# Altium schematic sheet top_schem_rev10.SchDoc
size A; SheetNumber: 1; SheetTotal: 1
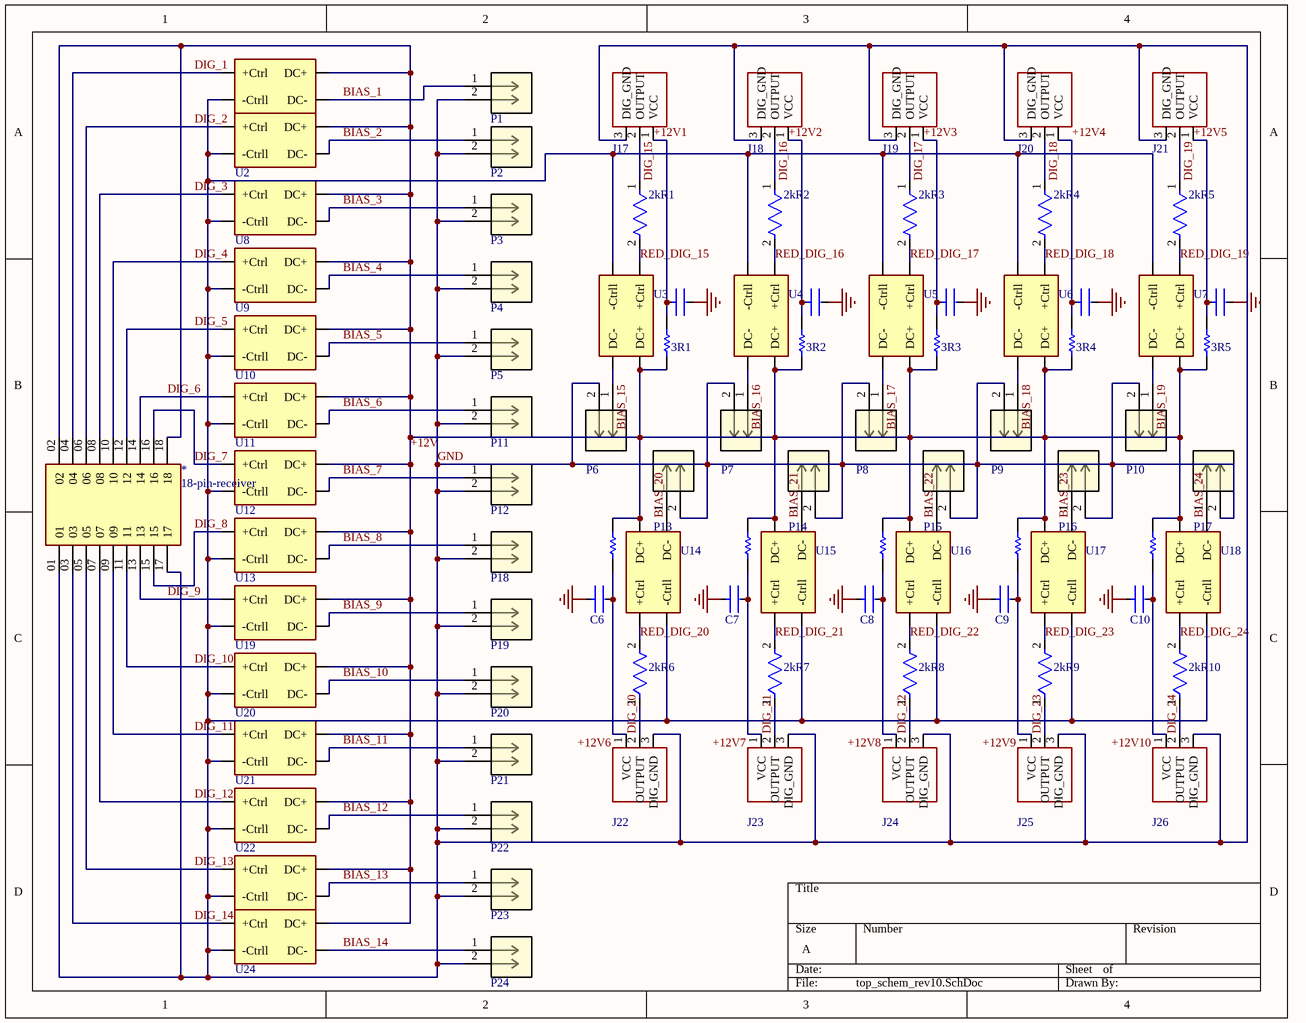
[diagram p0: top_schem_rev10.SchDoc]

## Parts
2kR1  CRCW06031K80FKEA  [2kOhm]  (value not drawn)
2kR2  CRCW06031K80FKEA  [2kOhm]  (value not drawn)
2kR3  CRCW06031K80FKEA  [2kOhm]  (value not drawn)
2kR4  CRCW06031K80FKEA  [2kOhm]  (value not drawn)
2kR5  CRCW06031K80FKEA  [2kOhm]  (value not drawn)
2kR6  CRCW06031K80FKEA  [2kOhm]  (value not drawn)
2kR7  CRCW06031K80FKEA  [2kOhm]  (value not drawn)
2kR8  CRCW06031K80FKEA  [2kOhm]  (value not drawn)
2kR9  CRCW06031K80FKEA  [2kOhm]  (value not drawn)
2kR10  CRCW06031K80FKEA  [2kOhm]  (value not drawn)
3R1  ERJ-2BQJR30X  [03 Ohm]  (value not drawn)
3R2  ERJ-2BQJR30X  [03 Ohm]  (value not drawn)
3R3  ERJ-2BQJR30X  [03 Ohm]  (value not drawn)
3R4  ERJ-2BQJR30X  [03 Ohm]  (value not drawn)
3R5  ERJ-2BQJR30X  [03 Ohm]  (value not drawn)
3R6  ERJ-2BQJR30X  [03 Ohm]  (value not drawn)
3R7  ERJ-2BQJR30X  [03 Ohm]  (value not drawn)
3R8  ERJ-2BQJR30X  [03 Ohm]  (value not drawn)
3R9  ERJ-2BQJR30X  [03 Ohm]  (value not drawn)
3R10  ERJ-2BQJR30X  [03 Ohm]  (value not drawn)
*  18-pin-receiver  [18-pin-receiver]
C1  C0805C104K5RACTU  [100nF]  (value not drawn)
C2  C0805C104K5RACTU  [100nF]  (value not drawn)
C3  C0805C104K5RACTU  [100nF]  (value not drawn)
C4  C0805C104K5RACTU  [100nF]  (value not drawn)
C5  C0805C104K5RACTU  [100nF]  (value not drawn)
C6  C0805C104K5RACTU  [100nF]  (value not drawn)
C7  C0805C104K5RACTU  [100nF]  (value not drawn)
C8  C0805C104K5RACTU  [100nF]  (value not drawn)
C9  C0805C104K5RACTU  [100nF]  (value not drawn)
C10  C0805C104K5RACTU  [100nF]  (value not drawn)
J17  IF-D95T  [IF-D95]  (value not drawn)
J18  IF-D95T  [IF-D95]  (value not drawn)
J19  IF-D95T  [IF-D95]  (value not drawn)
J20  IF-D95T  [IF-D95]  (value not drawn)
J21  IF-D95T  [IF-D95]  (value not drawn)
J22  IF-D95T  [IF-D95]  (value not drawn)
J23  IF-D95T  [IF-D95]  (value not drawn)
J24  IF-D95T  [IF-D95]  (value not drawn)
J25  IF-D95T  [IF-D95]  (value not drawn)
J26  IF-D95T  [IF-D95]  (value not drawn)
P1  1054311102  [CONN_1054311102_MOL]  (value not drawn)
P2  1054311102  [CONN_1054311102_MOL]  (value not drawn)
P3  1054311102  [CONN_1054311102_MOL]  (value not drawn)
P4  1054311102  [CONN_1054311102_MOL]  (value not drawn)
P5  1054311102  [CONN_1054311102_MOL]  (value not drawn)
P6  1054311102  [CONN_1054311102_MOL]  (value not drawn)
P7  1054311102  [CONN_1054311102_MOL]  (value not drawn)
P8  1054311102  [CONN_1054311102_MOL]  (value not drawn)
P9  1054311102  [CONN_1054311102_MOL]  (value not drawn)
P10  1054311102  [CONN_1054311102_MOL]  (value not drawn)
P11  1054311102  [CONN_1054311102_MOL]  (value not drawn)
P12  1054311102  [CONN_1054311102_MOL]  (value not drawn)
P13  1054311102  [CONN_1054311102_MOL]  (value not drawn)
P14  1054311102  [CONN_1054311102_MOL]  (value not drawn)
P15  1054311102  [CONN_1054311102_MOL]  (value not drawn)
P16  1054311102  [CONN_1054311102_MOL]  (value not drawn)
P17  1054311102  [CONN_1054311102_MOL]  (value not drawn)
P18  1054311102  [CONN_1054311102_MOL]  (value not drawn)
P19  1054311102  [CONN_1054311102_MOL]  (value not drawn)
P20  1054311102  [CONN_1054311102_MOL]  (value not drawn)
P21  1054311102  [CONN_1054311102_MOL]  (value not drawn)
P22  1054311102  [CONN_1054311102_MOL]  (value not drawn)
P23  1054311102  [CONN_1054311102_MOL]  (value not drawn)
P24  1054311102  [CONN_1054311102_MOL]  (value not drawn)
U1  Solid state relay  [CPC1002N]  (value not drawn)
U2  Solid state relay  [CPC1002N]  (value not drawn)
U3  Solid state relay  [CPC1002N]  (value not drawn)
U4  Solid state relay  [CPC1002N]  (value not drawn)
U5  Solid state relay  [CPC1002N]  (value not drawn)
U6  Solid state relay  [CPC1002N]  (value not drawn)
U7  Solid state relay  [CPC1002N]  (value not drawn)
U8  Solid state relay  [CPC1002N]  (value not drawn)
U9  Solid state relay  [CPC1002N]  (value not drawn)
U10  Solid state relay  [CPC1002N]  (value not drawn)
U11  Solid state relay  [CPC1002N]  (value not drawn)
U12  Solid state relay  [CPC1002N]  (value not drawn)
U13  Solid state relay  [CPC1002N]  (value not drawn)
U14  Solid state relay  [CPC1002N]  (value not drawn)
U15  Solid state relay  [CPC1002N]  (value not drawn)
U16  Solid state relay  [CPC1002N]  (value not drawn)
U17  Solid state relay  [CPC1002N]  (value not drawn)
U18  Solid state relay  [CPC1002N]  (value not drawn)
U19  Solid state relay  [CPC1002N]  (value not drawn)
U20  Solid state relay  [CPC1002N]  (value not drawn)
U21  Solid state relay  [CPC1002N]  (value not drawn)
U22  Solid state relay  [CPC1002N]  (value not drawn)
U23  Solid state relay  [CPC1002N]  (value not drawn)
U24  Solid state relay  [CPC1002N]  (value not drawn)

## Nets
GND: *.01 *.17 C1.2 C2.2 C3.2 C4.2 C5.2 C6.1 C7.1 C8.1 C9.1 C10.1 J17.3(DIG_GND) J18.3(DIG_GND) J19.3(DIG_GND) J20.3(DIG_GND) J21.3(DIG_GND) J22.3(DIG_GND) J23.3(DIG_GND) J24.3(DIG_GND) J25.3(DIG_GND) J26.3(DIG_GND) P1.2 P2.2 P3.2 P4.2 P5.2 P6.2 P7.2 P8.2 P9.2 P10.2 P11.2 P12.2 P13.2 P14.2 P15.2 P16.2 P17.2 P18.2 P19.2 P20.2 P21.2 P22.2 P23.2 P24.2 U1.2(-Ctrll) U2.2(-Ctrll) U3.2(-Ctrll) U4.2(-Ctrll) U5.2(-Ctrll) U6.2(-Ctrll) U7.2(-Ctrll) U8.2(-Ctrll) U9.2(-Ctrll) U10.2(-Ctrll) U11.2(-Ctrll) U12.2(-Ctrll) U13.2(-Ctrll) U14.2(-Ctrll) U15.2(-Ctrll) U16.2(-Ctrll) U17.2(-Ctrll) U18.2(-Ctrll) U19.2(-Ctrll) U20.2(-Ctrll) U21.2(-Ctrll) U22.2(-Ctrll) U23.2(-Ctrll) U24.2(-Ctrll)
+12V: 3R1.1 3R2.1 3R3.1 3R4.1 3R5.1 3R6.2 3R7.2 3R8.2 3R9.2 3R10.2 *.02 *.18 U1.4(DC+) U2.4(DC+) U3.4(DC+) U4.4(DC+) U5.4(DC+) U6.4(DC+) U7.4(DC+) U8.4(DC+) U9.4(DC+) U10.4(DC+) U11.4(DC+) U12.4(DC+) U13.4(DC+) U14.4(DC+) U15.4(DC+) U16.4(DC+) U17.4(DC+) U18.4(DC+) U19.4(DC+) U20.4(DC+) U21.4(DC+) U22.4(DC+) U23.4(DC+) U24.4(DC+)
+12V1: 3R1.2 C1.1 J17.1(VCC)
+12V2: 3R2.2 C2.1 J18.1(VCC)
+12V3: 3R3.2 C3.1 J19.1(VCC)
+12V4: 3R4.2 C4.1 J20.1(VCC)
+12V5: 3R5.2 C5.1 J21.1(VCC)
+12V6: 3R6.1 C6.2 J22.1(VCC)
+12V7: 3R7.1 C7.2 J23.1(VCC)
+12V8: 3R8.1 C8.2 J24.1(VCC)
+12V9: 3R9.1 C9.2 J25.1(VCC)
+12V10: 3R10.1 C10.2 J26.1(VCC)
BIAS_1: P1.1 U1.3(DC-)
BIAS_2: P2.1 U2.3(DC-)
BIAS_3: P3.1 U8.3(DC-)
BIAS_4: P4.1 U9.3(DC-)
BIAS_5: P5.1 U10.3(DC-)
BIAS_6: P11.1 U11.3(DC-)
BIAS_7: P12.1 U12.3(DC-)
BIAS_8: P18.1 U13.3(DC-)
BIAS_9: P19.1 U19.3(DC-)
BIAS_10: P20.1 U20.3(DC-)
BIAS_11: P21.1 U21.3(DC-)
BIAS_12: P22.1 U22.3(DC-)
BIAS_13: P23.1 U23.3(DC-)
BIAS_14: P24.1 U24.3(DC-)
BIAS_15: P6.1 U3.3(DC-)
BIAS_16: P7.1 U4.3(DC-)
BIAS_17: P8.1 U5.3(DC-)
BIAS_18: P9.1 U6.3(DC-)
BIAS_19: P10.1 U7.3(DC-)
BIAS_20: P13.1 U14.3(DC-)
BIAS_21: P14.1 U15.3(DC-)
BIAS_22: P15.1 U16.3(DC-)
BIAS_23: P16.1 U17.3(DC-)
BIAS_24: P17.1 U18.3(DC-)
DIG_1: *.04 U1.1(+Ctrl)
DIG_2: *.06 U2.1(+Ctrl)
DIG_3: *.08 U8.1(+Ctrl)
DIG_4: *.10 U9.1(+Ctrl)
DIG_5: *.12 U10.1(+Ctrl)
DIG_6: *.14 U11.1(+Ctrl)
DIG_7: *.16 U12.1(+Ctrl)
DIG_8: *.15 U13.1(+Ctrl)
DIG_9: *.13 U19.1(+Ctrl)
DIG_10: *.11 U20.1(+Ctrl)
DIG_11: *.09 U21.1(+Ctrl)
DIG_12: *.07 U22.1(+Ctrl)
DIG_13: *.05 U23.1(+Ctrl)
DIG_14: *.03 U24.1(+Ctrl)
DIG_15: 2kR1.1 J17.2(OUTPUT)
DIG_16: 2kR2.1 J18.2(OUTPUT)
DIG_17: 2kR3.1 J19.2(OUTPUT)
DIG_18: 2kR4.1 J20.2(OUTPUT)
DIG_19: 2kR5.1 J21.2(OUTPUT)
DIG_20: 2kR6.1 J22.2(OUTPUT)
DIG_21: 2kR7.1 J23.2(OUTPUT)
DIG_22: 2kR8.1 J24.2(OUTPUT)
DIG_23: 2kR9.1 J25.2(OUTPUT)
DIG_24: 2kR10.1 J26.2(OUTPUT)
RED_DIG_15: 2kR1.2 U3.1(+Ctrl)
RED_DIG_16: 2kR2.2 U4.1(+Ctrl)
RED_DIG_17: 2kR3.2 U5.1(+Ctrl)
RED_DIG_18: 2kR4.2 U6.1(+Ctrl)
RED_DIG_19: 2kR5.2 U7.1(+Ctrl)
RED_DIG_20: 2kR6.2 U14.1(+Ctrl)
RED_DIG_21: 2kR7.2 U15.1(+Ctrl)
RED_DIG_22: 2kR8.2 U16.1(+Ctrl)
RED_DIG_23: 2kR9.2 U17.1(+Ctrl)
RED_DIG_24: 2kR10.2 U18.1(+Ctrl)

## Library data of the parts
2kR1-2kR10 = CRCW06031K80FKEA: Res Thick Film 0603 1.8K Ohm 1% 1/10W ±100ppm/°C Molded SMD Paper T/R; Manufacturer: Vishay; Resistance: 1.8kR; Power Rating: 100mW; Voltage Rating: 75V; Supplier 1: RSComponents; Manufacturer Part Number: CRCW06031K80FKEA; RoHS: Yes; Category: Chip SMD Resistors; Stock 1: 7900; Pricing 1: 50=0.06500, 500=0.06000, 1000=0.05600, 2000=0.05200, 4000=0.04800 (USD); Case/Package: 0603; Case Code (Metric): 1608; Case Code (Imperial): 0603; Contact Plating: Tin; Weight: 7.1E-05oz; Size Code: 0603; Min Operating Temperature: -55°C; Max Operating Temperature: 155°C; Resistor Type: Thick Film; Tolerance: 1%; Packaging: Tape and Reel; Package Quantity: 5000; Temperature Coefficient: 100ppm/°C; Series: CRCW; Resistance Tolerance: 1%; Number of Terminations: 2; Max Power Dissipation: 100mW; Termination: SMD/SMT; Construction: Rectangular; Voltage Rating (DC): 75V; Features: Automotive AEC-Q200; Technology: THICK FILM; Length: 1.55mm; Width: 0.033inch; Height: 0.45mm; Depth: 0.85mm; Radiation Hardening: No; RoHS Compliant: Yes; REACH SVHC: Unknown; Military Standard: Not; Lead Free: Lead Free; ComponentLink1URL: https://datasheet.ciiva.com/11809/0900766b80d98afc-11809198.pdf?src-supplier=RSComponents; ComponentLink1Description: https://datasheet.ciiva.com/11809/0900766b80d98afc-11809198.pdf?src-supplier=RSComponents; ComponentLink2URL: https://datasheet.ciiva.com/2559/dcrcwe3-2559458.pdf?src-supplier=Digi-Key; ComponentLink2Description: https://datasheet.ciiva.com/2559/dcrcwe3-2559458.pdf?src-supplier=Digi-Key; ComponentLink3URL: https://datasheet.ciiva.com/2559/dcrcwe3-2559459.pdf?src-supplier=Digi-Key; ComponentLink3Description: https://datasheet.ciiva.com/2559/dcrcwe3-2559459.pdf?src-supplier=Digi-Key; ComponentLink4URL: https://datasheet.ciiva.com/2559/dcrcwe3-2559460.pdf?src-supplier=Digi-Key; ComponentLink4Description: https://datasheet.ciiva.com/2559/dcrcwe3-2559460.pdf?src-supplier=Digi-Key; ComponentLink5URL: https://datasheet.ciiva.com/3257/dcrcwe3-3257191.pdf?src-supplier=Avnet; ComponentLink5Description: https://datasheet.ciiva.com/3257/dcrcwe3-3257191.pdf?src-supplier=Avnet; ComponentLink6URL: https://datasheet.ciiva.com/5547/dcrcwe3-109170-5547689.pdf?src-supplier=Mouser; ComponentLink6Description: https://datasheet.ciiva.com/5547/dcrcwe3-109170-5547689.pdf?src-supplier=Mouser; ComponentLink7URL: https://datasheet.ciiva.com/26314/fld-crcw-e3-data-en-26314680.pdf?src-supplier=Distrelec; ComponentLink7Description: https://datasheet.ciiva.com/26314/fld-crcw-e3-data-en-26314680.pdf?src-supplier=Distrelec; ComponentLink8URL: https://datasheet.ciiva.com/22872/70201119-22872444.pdf?src-supplier=Allied+Electronics; ComponentLink8Description: https://datasheet.ciiva.com/22872/70201119-22872444.pdf?src-supplier=Allied+Electronics; ComponentLink9URL: https://datasheet.ciiva.com/7673/1533075-7673143.pdf?src-supplier=Element14; ComponentLink9Description: https://datasheet.ciiva.com/7673/1533075-7673143.pdf?src-supplier=Element14
3R1-3R10 = ERJ-2BQJR30X: RES 0.3 OHM 5% 1/6W 0402; Manufacturer: Panasonic; Max Power Dissipation: 167mW; Temperature Coefficient: 250ppm/°C; Resistance: 300mR; Supplier 1: Digi-Key; Supplier Part Number 1: P17347CT-ND; Manufacturer Part Number: ERJ-2BQJR30X; RoHS: Yes; Category: Chip SMD Resistors; Stock 1: 18282; Pricing 1: 1=0.21000, 10=0.17600, 25=0.12800, 50=0.09280, 100=0.06880, 250=0.05280, 500=0.04160, 1000=0.02880, 5000=0.02400 (USD); Case/Package: 0402; Case Code (Imperial): 0402; Case Code (Metric): 1005; Min Operating Temperature: -55°C; Max Operating Temperature: 125°C; Features: Automotive AEC-Q200; Tolerance: 5%; Packaging: Tape and Reel; Resistor Type: Thick Film; Number of Terminations: 2; Length: 0.039inch; Width: 0.02inch; Height: 0.016inch; ComponentLink1URL: http://www.mouser.com/ds/2/315/AOA0000C295-1109214.pdf?src-supplier=Mouser; ComponentLink1Description: http://www.mouser.com/ds/2/315/AOA0000C295-1109214.pdf?src-supplier=Mouser; ComponentLink2URL: https://industrial.panasonic.com/cdbs/www-data/pdf/RDN0000/AOA0000C313.pdf?src-supplier=Digi-Key; ComponentLink2Description: https://industrial.panasonic.com/cdbs/www-data/pdf/RDN0000/AOA0000C313.pdf?src-supplier=Digi-Key
C1-C10 = C0805C104K5RACTU: Cap Ceramic 0.1uF 50V X7R 10% SMD 2.0 x 1.2 mm 125 C Paper T/R; Manufacturer: KEMET; Voltage: 500V; Supplier 1: Digi-Key; Supplier Part Number 1: 399-1170-1-ND; Manufacturer Part Number: C0805C104K5RACTU; RoHS: Yes; Category: Ceramic Capacitors; Stock 1: 2447786; Pricing 1: 1=0.15000, 10=0.11000, 50=0.06220, 100=0.05150, 500=0.03612, 1000=0.02991 (USD); Mount: Surface Mount,PCB; Case/Package: 0805; Number of Pins: 2; Case Code (Imperial): 0805; Case Code (Metric): 2012; Contact Plating: Tin,Matte; Dielectric Material: Ceramic; Min Operating Temperature: -55°C; Max Operating Temperature: 125°C; Capacitance: 100nF; Voltage Rating: 50V; Tolerance: 10%; Packaging: Tape and Reel; Dielectric: X7R; Package Quantity: 4000; Voltage Rating (DC): 50V; Series: C0805C; Termination: SMD/SMT; Construction: Flat; Length: 2mm; Width: 1.2mm; Height: 0.9mm; Thickness: 0.035inch; Depth: 1.25mm; Lead Pitch: 0.75mm; Radiation Hardening: No; RoHS Compliant: Yes; REACH SVHC: No SVHC; ComponentLink1URL: https://datasheet.ciiva.com/28682/1851736-28682232.pdf?src-supplier=Element14; ComponentLink1Description: https://datasheet.ciiva.com/28682/1851736-28682232.pdf?src-supplier=Element14; ComponentLink2URL: https://datasheet.ciiva.com/14589/70095383-14589048.pdf?src-supplier=Allied+Electronics; ComponentLink2Description: https://datasheet.ciiva.com/14589/70095383-14589048.pdf?src-supplier=Allied+Electronics; ComponentLink3URL: https://datasheet.ciiva.com/32431/slceramic-chip-condensers-e-32431755.pdf?src-supplier=Distrelec; ComponentLink3Description: https://datasheet.ciiva.com/32431/slceramic-chip-condensers-e-32431755.pdf?src-supplier=Distrelec; ComponentLink4URL: https://datasheet.ciiva.com/18410/70095383-18410815.pdf?src-supplier=Allied+Electronics; ComponentLink4Description: https://datasheet.ciiva.com/18410/70095383-18410815.pdf?src-supplier=Allied+Electronics
J17-J26 = IF-D95T: DETECTOR PHOTOLOGIC TTL/CMOS; Manufacturer: Industrial Fiber Optics; Data Rate: 125Kbps; Operating Supply Current: 6mA; Rise Time: 70ns; Supplier 1: Digi-Key; Supplier Part Number 1: FB123-ND; Manufacturer Part Number: IF-D95T; RoHS: No; Category: Fiber Optic Cables; Package Quantity: 50; Lead Free: Contains Lead; ComponentLink1URL: https://datasheet.ciiva.com/2106/ifd95-2106550.pdf?src-supplier=Digi-Key; ComponentLink1Description: https://datasheet.ciiva.com/2106/ifd95-2106550.pdf?src-supplier=Digi-Key
P1-P24 = 1054311102: Nano-Fit Vertical Header, Surface Mount, 2.50mm Pitch, Single Row, 2 Circuits, 0.76 u00B5m Tin (Sn) Plating, Black,...; Manufacturer: Molex; Supplier 1: Digi-Key; Supplier Part Number 1: WM26073CT-ND; Manufacturer Part Number: 1054311102; RoHS: No; Category: Connectors; Stock 1: 1192; Pricing 1: 1=2.05000, 10=1.85700, 100=1.59160 (USD)
U1-U24 = CPC1002N